# EAGLE design RF Duinode V3 (EAGLE 5.11)
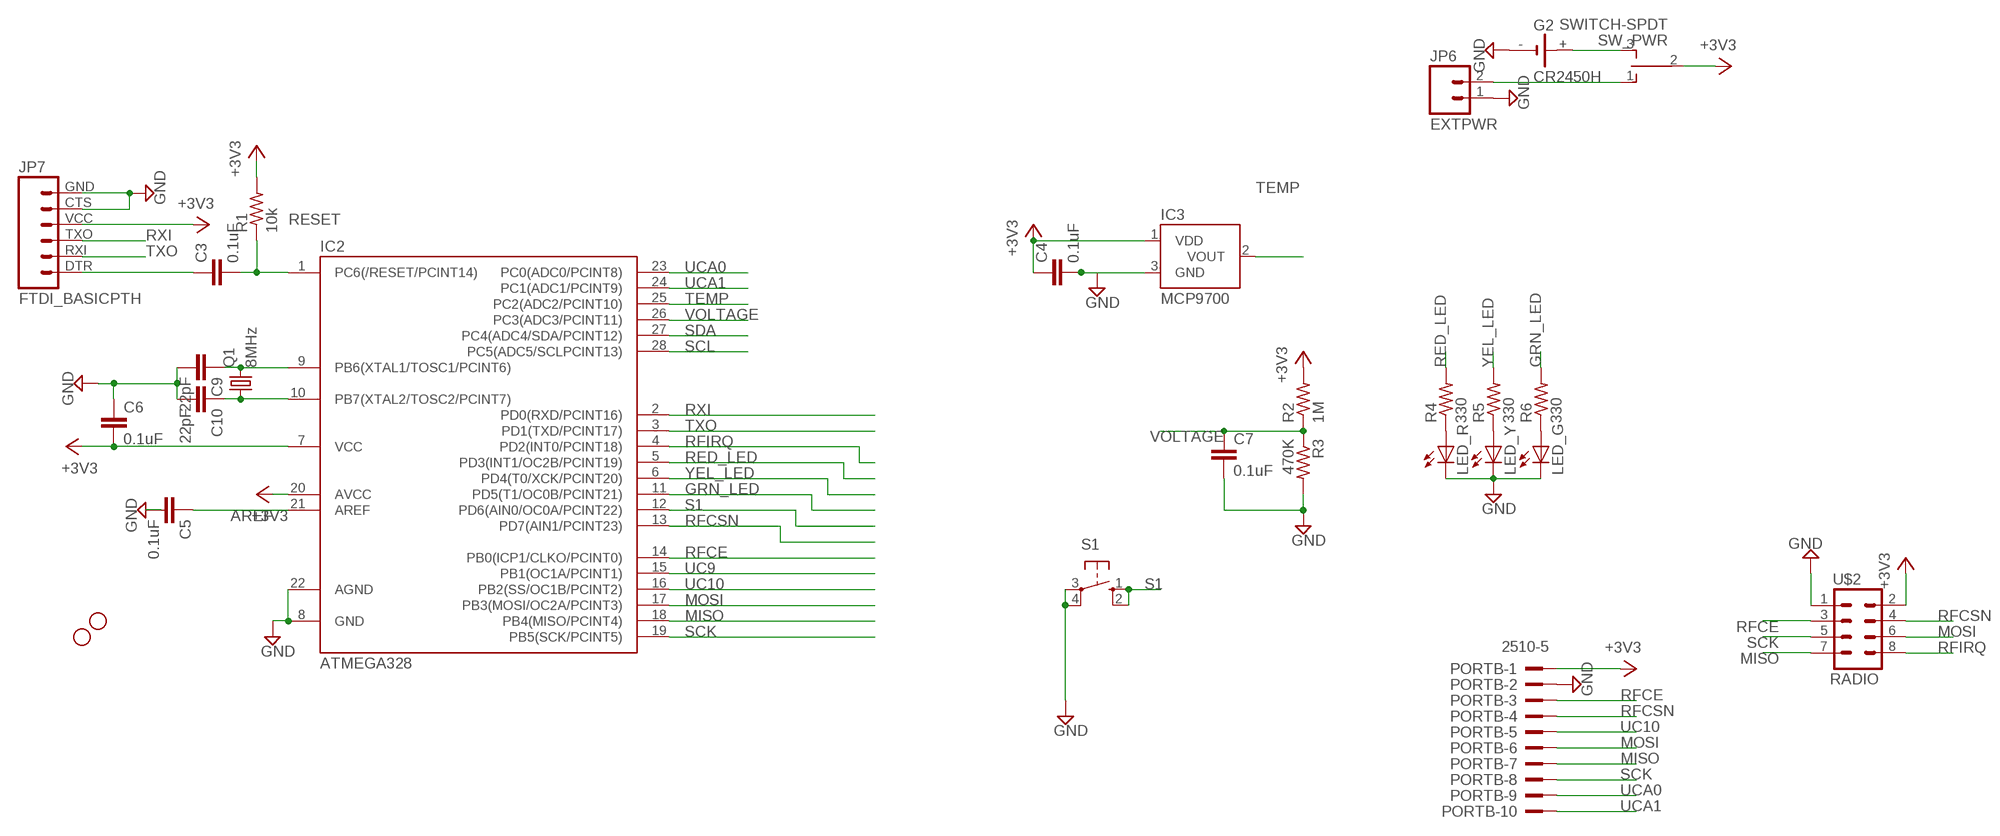
[diagram p0: schematic, sheet 1]

## Parts
C3  0.1uF  C-EU025-025X050  [C025-025X050]
C4  0.1uF  C-EU025-025X050  [C025-025X050]
C5  0.1uF  C-EU025-025X050  [C025-025X050]
C6  0.1uF  C-EU025-025X050  [C025-025X050]
C7  0.1uF  C-EU025-025X050  [C025-025X050]
C9  22pF  C-EU025-025X050  [C025-025X050]
C10  22pF  C-EU025-025X050  [C025-025X050]
G2  CR2450H  [122-00224-GR]
IC2  ATMEGA328  ATMEGA48/88/168-PU  [DIL28-3]
IC3  MCP9700  [TO-92]
JP2  STAND-OFF  [STAND-OFF]
JP6  EXTPWR  M02LOCK  [1X02_LOCK]
JP7  FTDI_BASICPTH  [FTDI_BASIC]
JP8  STAND-OFF  [STAND-OFF]
LED_G  LED3MM  [LED3MM]
LED_R  LED3MM  [LED3MM]
LED_Y  LED3MM  [LED3MM]
PORTB  2510-5  [PAK100/2500-5-10]
Q1  8MHz  CRYSTALHC49S  [HC49/S]
R1  10k  R-US_0204/2V  [0204V]
R2  1M  R-US_0204/2V  [0204V]
R3  470K  R-US_0204/2V  [0204V]
R4  330  R-US_0204/2V  [0204V]
R5  330  R-US_0204/2V  [0204V]
R6  330  R-US_0204/2V  [0204V]
S1  10-XX  [B3F-10XX]
SW_PWR  SWITCH-SPDT  [OS102011MS2QN1]
U$2  RADIO  M04X2  [2X4]

## Nets
+3V3: C4.1 C6.2 IC2.7(VCC) IC2.20(AVCC) IC3.1(VDD) JP7.VCC PORTB.1 R1.2 R2.2 SW_PWR.2(P) U$2.2
AREF: C5.1 IC2.21(AREF)
COIN: G2.+ SW_PWR.3(S)
DTR: C3.1 JP7.DTR
EXTPWR: JP6.2 SW_PWR.1(O)
GND: C4.2 C5.2 C6.1 C7.2 C9.2 C10.2 G2.- IC2.8(GND) IC2.22(AGND) IC3.3(GND) JP6.1 JP7.CTS JP7.GND LED_G.K(C) LED_R.K(C) LED_Y.K(C) PORTB.2 R3.2 S1.3(P) S1.4(P1) U$2.1
GRN_LED: IC2.11(PD5(T1/OC0B/PCINT21)) R6.2
MISO: IC2.18(PB4(MISO/PCINT4)) PORTB.7 U$2.7
MOSI: IC2.17(PB3(MOSI/OC2A/PCINT3)) PORTB.6 U$2.6
N$2: LED_R.A R4.1
N$3: LED_Y.A R5.1
N$4: LED_G.A R6.1
RED_LED: IC2.5(PD3(INT1/OC2B/PCINT19)) R4.2
RESET: C3.2 IC2.1(PC6(/RESET/PCINT14)) R1.1
RFCE: IC2.14(PB0(ICP1/CLKO/PCINT0)) PORTB.3 U$2.3
RFCSN: IC2.13(PD7(AIN1/PCINT23)) PORTB.4 U$2.4
RFIRQ: IC2.4(PD2(INT0/PCINT18)) U$2.8
RXI: IC2.2(PD0(RXD/PCINT16)) JP7.TXO
S1: IC2.12(PD6(AIN0/OC0A/PCINT22)) S1.1(S) S1.2(S1)
SCK: IC2.19(PB5(SCK/PCINT5)) PORTB.8 U$2.5
SCL: IC2.28(PC5(ADC5/SCLPCINT13))
SDA: IC2.27(PC4(ADC4/SDA/PCINT12))
TEMP: IC2.25(PC2(ADC2/PCINT10)) IC3.2(VOUT)
TXO: IC2.3(PD1(TXD/PCINT17)) JP7.RXI
UC9: IC2.15(PB1(OC1A/PCINT1))
UC10: IC2.16(PB2(SS/OC1B/PCINT2)) PORTB.5
UCA0: IC2.23(PC0(ADC0/PCINT8)) PORTB.9
UCA1: IC2.24(PC1(ADC1/PCINT9)) PORTB.10
VOLTAGE: C7.1 IC2.26(PC3(ADC3/PCINT11)) R2.1 R3.1
XTAL1: C9.1 IC2.9(PB6(XTAL1/TOSC1/PCINT6)) Q1.2
XTAL2: C10.1 IC2.10(PB7(XTAL2/TOSC2/PCINT7)) Q1.1
YEL_LED: IC2.6(PD4(T0/XCK/PCINT20)) R5.2

## Library data of the parts
C3-C7 C9 C10 = resistor:C-EU: CAPACITOR, European symbol
G2 = JC:CR2450H: CR2450 BATTERY Holder Renata Plastic Devices
IC2 = atmega8:ATMEGA48/88/168-PU
IC3 = JC:MCP9700
JP2 JP8 = SparkFun:STAND-OFF: Stand Off This is the mechanical footprint for a #4 phillips button head screw. Use the keepout ring to avoid running the screw head into surrounding components. SKU : PRT-00447
JP6 = SparkFun:M02: Header 2 Standard 2-pin 0.1" header. Use with straight break away headers (SKU : PRT-00116), right angle break away headers (PRT-00553), swiss pins (PRT-00743), machine pins (PRT-00117), and female headers (PRT-00115). Molex polarized connector foot print use with SKU : PRT-08233 with associated crimp pins and housings.
JP7 = SparkFun:FTDI_BASIC: FTDI Basic: 3.3V and 5V
LED_G LED_R LED_Y = led:LED: LED OSRAM: - CHIPLED LG R971, LG N971, LY N971, LG Q971, LY Q971, LO R971, LY R971 LH N974, LH R974 LS Q976, LO Q976, LY Q976 LO Q996 - Hyper CHIPLED LW Q18S LB Q993, LB Q99A, LB R99A - SideLED LS A670, LO A670, LY A670, LG A670, LP A670 LB A673, LV A673, LT A673, LW A673 LH A674 LY A675 LS A676, LA A676, LO A676, LY A676, LW A676 LS A679, LY A679, LG A679 - Hyper Micro SIDELED® LS Y876, LA Y876, LO Y876, LY Y876 LT Y87S - SmartLED LW L88C, LW L88S LB L89C, LB L89S, LG L890 LS L89K, LO L89K, LY L89K LS L896, LA L896, LO L896, LY L896 - TOPLED LS T670, LO T670, LY T670, LG T670, LP T670 LSG T670, LSP T670, LSY T670, LOP T670, LYG T670 LG T671, LOG T671, LSG T671 LB T673, LV T673, LT T673, LW T673 LH T674 LS T676, LA T676, LO T676, LY T676, LB T676, LH T676, LSB T676, LW T676 LB T67C, LV T67C, LT T67C, LS T67K, LO T67K, LY T67K, LW E67C LS E67B, LA E67B, LO E67B, LY E67B, LB E67C, LV E67C, LT E67C LW T67C LS T679, LY T679, LG T679 LS T770, LO T770, LY T770, LG T770, LP T770 LB T773, LV T773, LT T773, LW T773 LH T774 LS E675, LA E675, LY E675, LS T675 LS T776, LA T776, LO T776, LY T776, LB T776 LHGB T686 LT T68C, LB T68C - Hyper Mini TOPLED® LB M676 - Mini TOPLED Santana® LG M470 LS M47K, LO M47K, LY M47K Source: http://www.osram.convergy.de LUXEON: - LUMILED® LXK2-PW12-R00, LXK2-PW12-S00, LXK2-PW14-U00, LXK2-PW14-V00 LXK2-PM12-R00, LXK2-PM12-S00, LXK2-PM14-U00 LXK2-PE12-Q00, LXK2-PE12-R00, LXK2-PE12-S00, LXK2-PE14-T00, LXK2-PE14-U00 LXK2-PB12-K00, LXK2-PB12-L00, LXK2-PB12-M00, LXK2-PB14-N00, LXK2-PB14-P00, LXK2-PB14-Q00 LXK2-PR12-L00, LXK2-PR12-M00, LXK2-PR14-Q00, LXK2-PR14-R00 LXK2-PD12-Q00, LXK2-PD12-R00, LXK2-PD12-S00 LXK2-PH12-R00, LXK2-PH12-S00 LXK2-PL12-P00, LXK2-PL12-Q00, LXK2-PL12-R00 Source: www.luxeon.com KINGBRIGHT: KA-3528ASYC Source: www.kingbright.com
PORTB = con-3m:2510-: 3M (TM) Pak 100 4-Wall Header Source: 3M
Q1 = crystal:CRYSTAL: CRYSTAL
R1-R6 = resistor:R-US_: RESISTOR, American symbol
S1 = switch-omron:10-XX: OMRON SWITCH; MPN: B3F-1000; OC_FARNELL: 176432; OC_NEWARK: 36M3542
SW_PWR = JC:SWITCH-SPDT: TINY SWITCH ON OFF ON Source: http://www2.produktinfo.conrad.com/datenblaetter/700000-724999/705152-da-01-de-Subminiaturschalter_TL_36YO.pdf
U$2 = SparkFun:M04X2

## Net classes
0 default: width 0.203 mm, drill 0.33 mm, clearance 0.203 mm

## Board
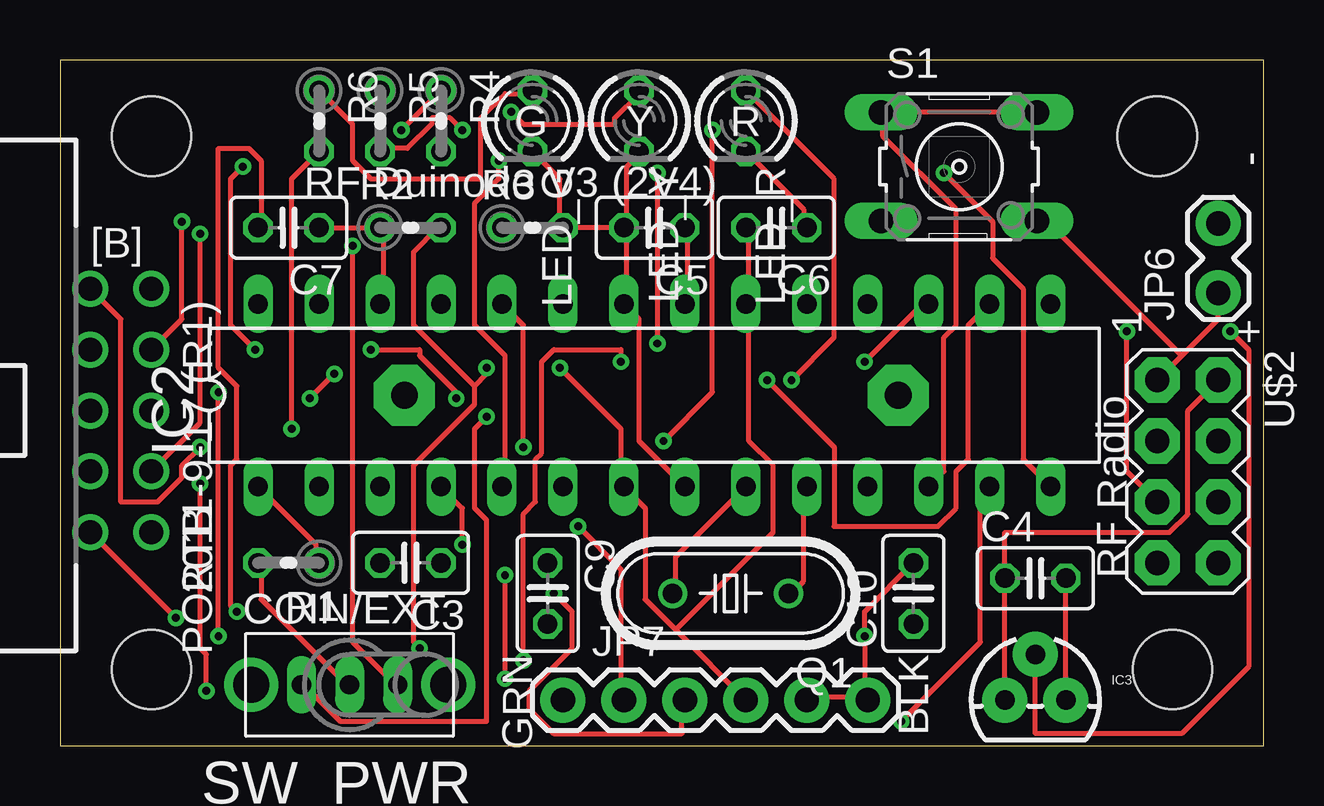
[diagram p1: board, top side]
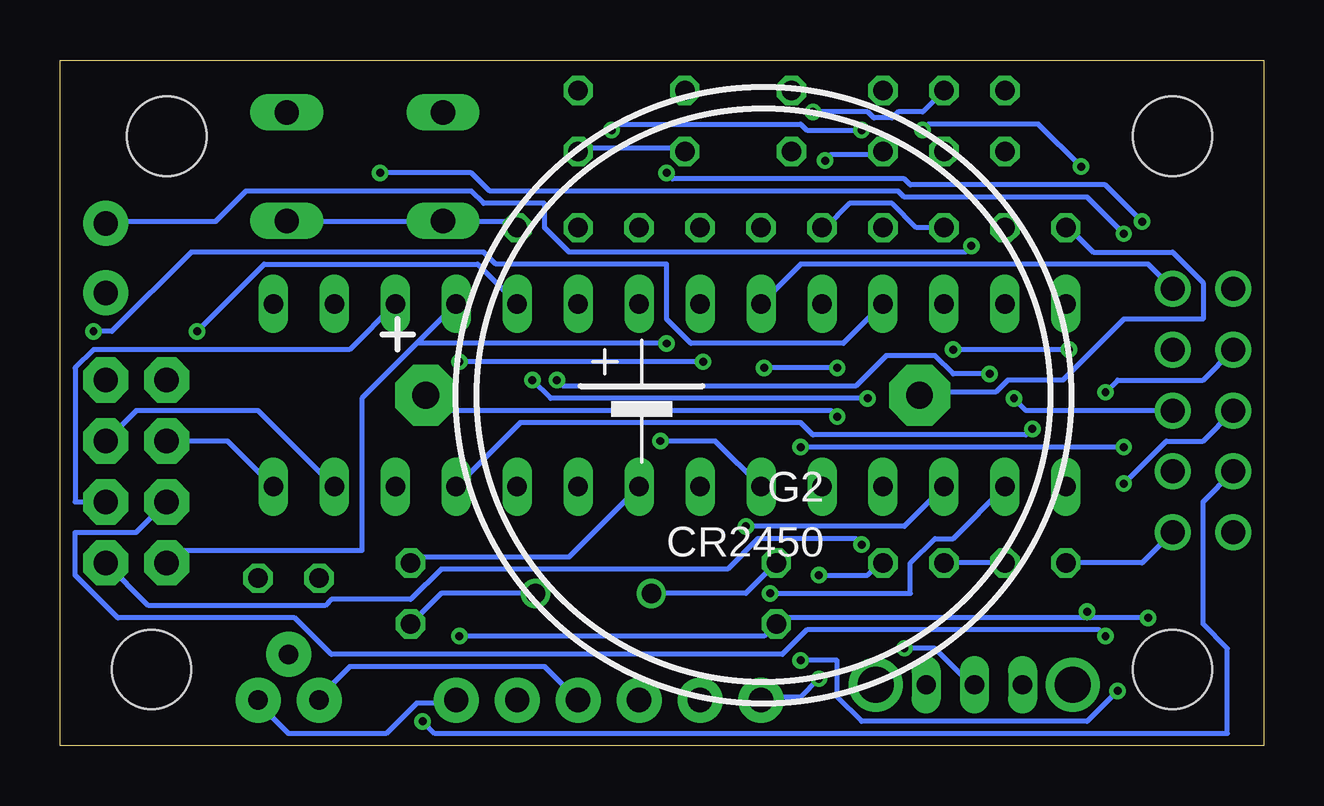
[diagram p2: board, bottom side, seen from below]

Size 50.16 x 28.57 mm. Coordinates in mm from the lower left corner, seen from the top.
Outline: 0,0 50.16,0 50.16,28.57 0,28.57 0,0
Copper layers (1*16): Top 0.0356mm / dielectric 1.5011mm / Bottom 0.0356mm
Design rules "LaenPCBOrder *": minimum track width 6mil, minimum drill 13mil, track to track 6mil, track to pad 6mil, pad to pad 6mil, via to via 6mil, smd to smd 6mil, copper to edge 15mil, drill to drill 6mil, minimum pad ring 7mil, minimum via ring 7mil, stop-mask expansion 4mil, vias tented up to drill 25mil, thermal gap 10mil

### Footprints (pad centres in the part's own frame; a part is rotated, then mirrored left to right if it is on the bottom)
C025-025X050 = drill 0.813 octagon: 1 -1.27,0; 2 1.27,0
122-00224-GR = drill 1.118 pad 2.54 octagon: + 0,14.072; - 0,-6.502
DIL28-3 = drill 0.813 long: 1 -16.51,-3.81; 2 -13.97,-3.81; 3 -11.43,-3.81; 4 -8.89,-3.81; 5 -6.35,-3.81; 6 -3.81,-3.81; 7 -1.27,-3.81; 8 1.27,-3.81; 9 3.81,-3.81; 10 6.35,-3.81; 11 8.89,-3.81; 12 11.43,-3.81; 13 13.97,-3.81; 14 16.51,-3.81; 15 16.51,3.81; 16 13.97,3.81; 17 11.43,3.81; 18 8.89,3.81; 19 6.35,3.81; 20 3.81,3.81; 21 1.27,3.81; 22 -1.27,3.81; 23 -3.81,3.81; 24 -6.35,3.81; 25 -8.89,3.81; 26 -11.43,3.81; 27 -13.97,3.81; 28 -16.51,3.81
TO-92 = drill 0.813 pad 1.88 round: 1 -1.27,0; 2 0,1.905; 3 1.27,0
STAND-OFF = hole 3.302: 0,0
1X02_LOCK = drill 1.016 pad 1.88 round: 1 -0.178,0; 2 2.718,0
FTDI_BASIC = drill 1.016 pad 1.88 round: CTS 10.16,0; DTR 0,0; GND 12.7,0; RXI 2.54,0; TXO 5.08,0; VCC 7.62,0
LED3MM = drill 0.813 octagon: A -1.27,0; K 1.27,0
PAK100/2500-5-10 = drill 1 pad 1.422 round: 1 -5.08,-1.27; 2 -5.08,1.27; 3 -2.54,-1.27; 4 -2.54,1.27; 5 0,-1.27; 6 0,1.27; 7 2.54,-1.27; 8 2.54,1.27; 9 5.08,-1.27; 10 5.08,1.27
HC49/S = drill 0.813 round: 1 -2.413,0; 2 2.413,0
0204V = drill 0.813 octagon: 1 -1.27,0; 2 1.27,0
B3F-10XX = drill 1.016 long: 1 -3.251,2.261; 2 3.251,2.261; 3 -3.251,-2.261; 4 3.251,-2.261
OS102011MS2QN1 = drill 0.8 pad 1.016 long: 1 -2.007,0; 2 0,0; 3 2.007,0 | drill 1.5 pad 1.778 round: M1 -4.102,0; M2 4.102,0
2X4 = drill 1.016 pad 1.88 octagon: 1 -3.81,-1.27; 2 -3.81,1.27; 3 -1.27,-1.27; 4 -1.27,1.27; 5 1.27,-1.27; 6 1.27,1.27; 7 3.81,-1.27; 8 3.81,1.27

### Placement (x,y rotation side)
C3  14.61,7.62 180 top
C4  40.64,6.99 0 top
C5  24.77,21.59 180 top
C6  29.84,21.59 180 top
C7  9.53,21.59 180 top
C9  20.32,6.35 270 top
C10  35.56,6.35 90 top
G2  20.85,14.61 90 bottom
IC2  24.77,14.61 0 top
IC3  40.64,1.91 0 top
JP1  STAND-OFF  [STAND-OFF]  45.72,25.4 0 top
JP2  3.81,3.17 0 top
JP6  48.26,19.05 90 top
JP7  20.95,1.91 0 top
JP8  3.81,25.4 0 top
JP9  STAND-OFF  [STAND-OFF]  46.35,3.17 0 top
LED_G  19.68,26.04 270 top
LED_R  28.57,26.04 270 top
LED_Y  24.13,26.04 270 top
PORTB  2.54,13.97 90 top
Q1  27.94,6.35 180 top
R1  9.53,7.62 180 top
R2  14.61,21.59 0 top
R3  19.68,21.59 0 top
R4  15.88,26.04 270 top
R5  13.34,26.04 270 top
R6  10.79,26.04 270 top
S1  37.47,24.13 0 top
SW_PWR  12.06,2.54 180 top
U$2  46.99,11.43 270 top

### Tracks (layer width: path | path; a pad name or v marks a point on that pad's centre or on a via)
+3V3  (via drill 0.33)
  Top 0.203: SW_PWR.2 11.94,2.54 8.38,6.1 8.38,7.62 R1.2 | 17.27,14.99 14.73,17.53 14.73,20.57 15.75,21.59 R2.2 | 17.27,14.99 17.27,14.22 14.73,11.68 14.73,4.32 v14.99,4.06 | IC3.1 C4.1 39.37,8.89 46.23,8.89 46.99,9.65 46.99,13.97 U$2.2 | C6.2 28.7,21.59 28.7,18.54 IC2.20 28.7,18.29 28.7,12.7 29.72,11.68 29.72,8.89 25.65,4.83 | 25.65,4.83 24.38,6.1 24.38,9.91 IC2.7 23.37,10.92 23.37,13.21 v20.83,15.75 | 25.65,4.83 JP7.VCC | 17.27,14.99 17.78,15.49 v17.78,15.75
  Bottom 0.203: v14.99,4.06 13.72,4.06 12.19,2.54 SW_PWR.2 | PORTB.1 5.08,7.62 R1.2 | IC3.1 39.37,2.03 38.1,3.3 29.97,3.3 JP7.VCC | v17.78,15.75 v20.83,15.75
AREF
  Top 0.203: IC2.21 26.16,18.54 26.16,21.59 C5.1
COIN  (via drill 0.33)
  Top 0.203: v17.78,13.72 17.27,13.21 17.27,9.91 17.78,9.4 17.78,1.02 11.68,1.02 10.16,2.54 SW_PWR.3
  Bottom 0.203: v17.78,13.72 18.03,13.97 34.29,13.97 G2.+
DTR  (via drill 0.33)
  Top 0.203: v18.54,2.79 v18.54,7.11
  Bottom 0.203: v18.54,7.11 16.51,7.11 16,7.62 C3.1 | v18.54,2.79 19.3,2.03 20.83,2.03 JP7.DTR
EXTPWR  (via drill 0.33)
  Top 0.203: v12.19,20.83 12.19,4.32 13.97,2.54 SW_PWR.1
  Bottom 0.203: v12.19,20.83 12.45,20.57 28.96,20.57 29.97,21.59 29.97,22.61 32.51,22.61 33.02,23.11 42.42,23.11 43.69,21.84 48.26,21.84 JP6.2
GND  (via drill 0.33)
  Top 0.203: 23.62,21.59 23.62,18.54 IC2.22 24.13,17.78 24.13,12.7 IC2.8 | LED_G.K 20.83,23.62 20.83,21.59 R3.2 C5.2 23.62,21.59 | 23.62,21.59 23.62,24.13 24.13,24.64 LED_Y.K | 46.74,16.26 48.26,17.78 JP6.1 | 46.74,16.26 U$2.1 | LED_R.K 30.99,22.35 30.99,21.59 C6.1 | 46.74,16.26 40.89,22.1 S1.4 | IC3.3 C4.2 | 33.53,2.03 v33.53,4.57 33.53,5.59 C10.2 | PORTB.2 v4.83,5.33 | 33.53,2.03 31.24,2.03 JP7.CTS | 33.53,2.03 JP7.GND | v7.37,5.59 7.11,5.84 7.11,11.68 7.37,11.94 7.37,14.99 6.6,15.75 6.6,24.89 7.87,24.89 8.38,24.38 8.38,21.59 C7.2
  Bottom 0.203: C6.1 31.24,21.59 31.5,21.84 34.04,21.84 S1.3 34.29,21.84 40.64,21.84 S1.4 | LED_Y.K 24.13,24.89 28.45,24.89 LED_R.K | C7.2 8.13,21.59 7.11,20.57 3.81,20.57 2.54,19.3 2.54,17.78 5.84,17.78 8.38,15.24 10.67,15.24 11.18,14.73 14.22,14.73 G2.- | v33.53,4.57 20.83,4.57 C9.2 20.07,5.33 7.37,5.33 | v4.83,5.33 7.37,5.33 | IC3.3 41.91,1.78 40.64,0.51 36.58,0.51 35.31,1.78 33.78,1.78 JP7.GND | 7.37,5.33 v7.37,5.59 | C10.2 35.31,7.87 28.96,7.87 IC2.8
GRN_LED  (via drill 0.33)
  Top 0.203: v9.65,13.21 9.65,23.62 R6.2
  Bottom 0.203: v9.65,13.21 9.91,12.95 18.8,12.95 19.3,13.46 30.99,13.46 IC2.11
MISO  (via drill 0.33)
  Top 0.203: PORTB.7 5.08,17.78 v5.08,21.84 | v24.89,23.88 v24.89,16.76
  Bottom 0.203: 35.31,16.76 37.59,14.48 37.59,8.13 45.21,8.13 U$2.7 | 35.31,16.76 IC2.18 | v5.08,21.84 6.6,23.37 14.73,23.37 14.99,23.62 24.64,23.62 v24.89,23.88 | v24.89,16.76 35.31,16.76
MOSI  (via drill 0.33)
  Top 0.203: v5.84,10.92 5.84,4.06 6.1,3.81 v6.1,2.29 | v19.3,3.56 19.3,9.65 19.81,10.16 19.81,11.94 20.07,12.19 20.07,16 20.57,16.51 23.37,16.51 v23.37,16 | v33.53,16 36.07,18.54 IC2.17
  Bottom 0.203: U$2.6 49.53,10.16 49.53,15.75 48.77,16.51 38.1,16.51 IC2.17 | PORTB.6 2.54,12.7 4.06,12.7 v5.84,10.92 | v6.1,2.29 7.37,1.02 16.76,1.02 17.78,2.03 17.78,3.56 v19.3,3.56 | v23.37,16 v33.53,16
N$2  (via drill 0.33)
  Top 0.203: v7.62,24.13 7.11,23.62 7.11,17.53 v8.13,16.51 | v12.95,16.51 14.99,16.51 14.99,16.26 16.51,14.73 v16.51,14.48 | v30.48,15.24 32.26,17.02 32.26,23.62 LED_R.A | v14.22,25.65 R4.1
  Bottom 0.203: v14.22,25.65 13.97,25.91 9.4,25.91 v7.62,24.13 | v8.13,16.51 v12.95,16.51 | v16.51,14.48 29.72,14.48 v30.48,15.24
N$3  (via drill 0.33)
  Top 0.203: v18.8,26.42 19.3,25.91 23.11,25.91 23.11,26.16 24.13,27.18 LED_Y.A
  Bottom 0.203: v18.8,26.42 16.51,26.42 16.26,26.16 15.49,26.16 15.24,26.42 14.22,26.42 R5.1
N$4
  Top 0.203: R6.1 12.19,25.91 12.19,24.38 12.95,23.62 17.53,23.62 17.53,26.16 18.54,27.18 19.56,27.18 LED_G.A
RED_LED  (via drill 0.33)
  Top 0.203: v18.29,24.38 18.29,23.62 17.27,22.61 17.27,17.53 18.54,16.26 18.54,10.92 IC2.5
  Bottom 0.203: v18.29,24.38 18.03,24.64 16,24.64 R4.2
RESET
  Top 0.203: IC2.1 10.67,8.38 10.67,7.62 R1.1
  Bottom 0.203: R1.1 C3.2
RFCE  (via drill 0.33)
  Top 0.203: PORTB.3 5.84,13.46 v5.84,21.34 | v36.83,23.88 38.86,21.84 38.86,20.32 40.13,19.05 40.13,11.94 IC2.14
  Bottom 0.203: U$2.3 43.18,12.7 IC2.14 | v5.84,21.34 7.37,22.86 14.99,22.86 15.24,23.11 32.26,23.11 33.02,23.88 v36.83,23.88
RFCSN  (via drill 0.33)
  Top 0.203: v35.05,1.02 38.35,4.32 38.35,10.41 IC2.13
  Bottom 0.203: U$2.4 46.99,13.97 41.91,13.97 IC2.13 | PORTB.4 2.54,10.16 2.54,5.08 1.52,4.06 1.52,0.51 34.54,0.51 v35.05,1.02
RFIRQ  (via drill 0.33)
  Top 0.203: v16.76,8.38 16.76,9.91 IC2.4
  Bottom 0.203: v16.76,8.38 17.02,8.64 21.08,8.64 22.35,7.37 34.29,7.37 35.56,6.1 38.86,6.1 39.12,5.84 46.48,5.84 U$2.8
RXI  (via drill 0.33)
  Top 0.203: v20.57,6.35 21.34,5.59 21.34,4.06 19.56,2.29 19.56,1.52 20.57,0.51 25.91,0.51 25.91,1.78 JP7.TXO
  Bottom 0.203: v20.57,6.35 14.73,6.35 14.73,7.62 13.72,8.64 12.95,8.64 IC2.2
S1
  Top 0.203: IC2.12 36.83,11.43 36.83,17.02 37.34,17.53 37.34,22.35 34.29,25.4 34.29,26.16 S1.1 34.29,26.42 40.64,26.42 S1.2
SCK  (via drill 0.33)
  Top 0.203: v44.45,17.27 44.45,11.43 U$2.5 | v6.6,4.57 v6.6,14.73
  Bottom 0.203: v44.45,17.27 41.66,20.07 32.77,20.07 IC2.19 | PORTB.8 2.54,15.24 6.1,15.24 v6.6,14.73 | v6.6,4.57 6.86,4.83 19.05,4.83 20.07,3.81 38.86,3.81 40.39,5.33 47.75,5.33 49.53,7.11 49.53,8.89 46.99,8.89 U$2.5
TEMP  (via drill 0.33)
  Top 0.203: v48.77,17.27 49.53,16.51 49.53,3.3 46.74,0.51 40.64,0.51 IC3.2
  Bottom 0.203: v48.77,17.27 48.01,17.27 44.7,20.57 32.51,20.57 32,20.07 24.89,20.07 24.89,17.78 23.88,16.76 17.53,16.76 IC2.25
TXO  (via drill 0.33)
  Top 0.203: v21.59,9.14 23.37,7.37 23.37,2.03 JP7.RXI
  Bottom 0.203: v21.59,9.14 14.99,9.14 IC2.3
UC10  (via drill 0.33)
  Top 0.203: v29.46,15.24 32.26,12.45 32.26,9.14 36.58,9.14 37.34,9.91 37.34,11.43 37.85,11.94 37.85,17.53 IC2.16 | v10.41,14.48 v11.43,15.49
  Bottom 0.203: v29.46,15.24 29.21,14.99 17.02,14.99 15.75,16.26 13.72,16.26 12.95,15.49 v11.43,15.49 | v10.41,14.48 9.91,13.97 PORTB.5
UCA0
  Bottom 0.203: PORTB.9 4.83,20.07 19.3,20.07 IC2.23
UCA1  (via drill 0.33)
  Top 0.203: v19.3,12.45 19.3,17.53 IC2.24 | v5.84,12.45 5.08,11.68 5.08,11.18 4.06,10.16 2.54,10.16 2.54,17.78 PORTB.10
  Bottom 0.203: v5.84,12.45 v19.3,12.45
VOLTAGE
  Top 0.203: IC2.26 13.46,18.54 13.46,21.59 R2.1 C7.1
  Bottom 0.203: R3.1 18.29,21.59 17.27,22.61 15.49,22.61 14.48,21.59 R2.1
XTAL1
  Top 0.203: IC2.9 25.65,7.87 25.65,6.35 Q1.2
  Bottom 0.203: C9.1 21.59,6.35 Q1.2
XTAL2
  Top 0.203: Q1.1 30.48,6.35 30.99,6.86 30.99,10.67 IC2.10
  Bottom 0.203: C10.1 34.29,6.35 Q1.1
YEL_LED  (via drill 0.33)
  Top 0.203: v25.15,12.7 27.18,14.73 v27.18,25.65 | v16.76,25.65 16.26,26.16 15.49,26.16 15.49,25.91 14.48,24.89 13.46,24.89 R5.2
  Bottom 0.203: v25.15,12.7 22.86,12.7 IC2.6 | v27.18,25.65 26.92,25.91 19.3,25.91 19.05,25.65 v16.76,25.65

### Text on the board
tPlace: G | Y | R | - | RF Duinode V3 (2V4) | [B] | + | 1 | RF Radio | 2011-9-17 (R1) | COIN/EXT | GRN | BLK